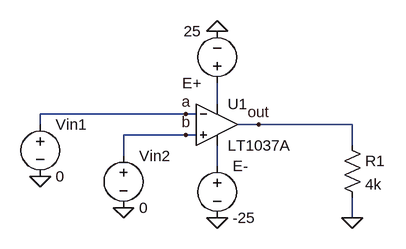
[diagram p0: schematic 1.asc]
1.asc, the LTspice schematic file:
Version 4
SHEET 1 880 680
WIRE 208 160 208 128
WIRE 160 176 -64 176
WIRE 176 176 160 176
WIRE -64 192 -64 176
WIRE 272 192 240 192
WIRE 416 192 272 192
WIRE 160 208 64 208
WIRE 176 208 160 208
WIRE 416 224 416 192
WIRE 64 240 64 208
WIRE 208 256 208 224
WIRE 416 336 416 304
FLAG 208 336 0
FLAG 208 48 0
FLAG 64 320 0
FLAG -64 272 0
FLAG 416 336 0
FLAG 160 176 a
FLAG 160 208 b
FLAG 272 192 out
SYMBOL Opamps\\LT1037A 208 128 R0
SYMATTR InstName U1
SYMBOL voltage 64 224 R0
WINDOW 123 0 0 Left 2
WINDOW 39 0 0 Left 2
SYMATTR InstName Vin2
SYMATTR Value 0
SYMBOL voltage -64 176 R0
WINDOW 123 0 0 Left 2
WINDOW 39 0 0 Left 2
SYMATTR InstName Vin1
SYMATTR Value 0
SYMBOL voltage 208 144 R180
WINDOW 123 0 0 Left 2
WINDOW 39 0 0 Left 2
SYMATTR InstName E+
SYMATTR Value 25
SYMBOL voltage 208 240 R0
WINDOW 123 0 0 Left 2
WINDOW 39 0 0 Left 2
SYMATTR InstName E-
SYMATTR Value -25
SYMBOL res 400 208 R0
SYMATTR InstName R1
SYMATTR Value 4k

The netlist it stands for:
* 1.asc
XU1 b a N001 N002 out LT1037A  ; pins In+ In- V+ V- OUT
Vin2 b 0 0
Vin1 a 0 0
V§E+ N001 0 25
V§E- N002 0 -25
R1 out 0 4k
.backanno
.end